# EAGLE design stage1_amp_flat_switch_5V_V1p1 (EAGLE 9.6.2)
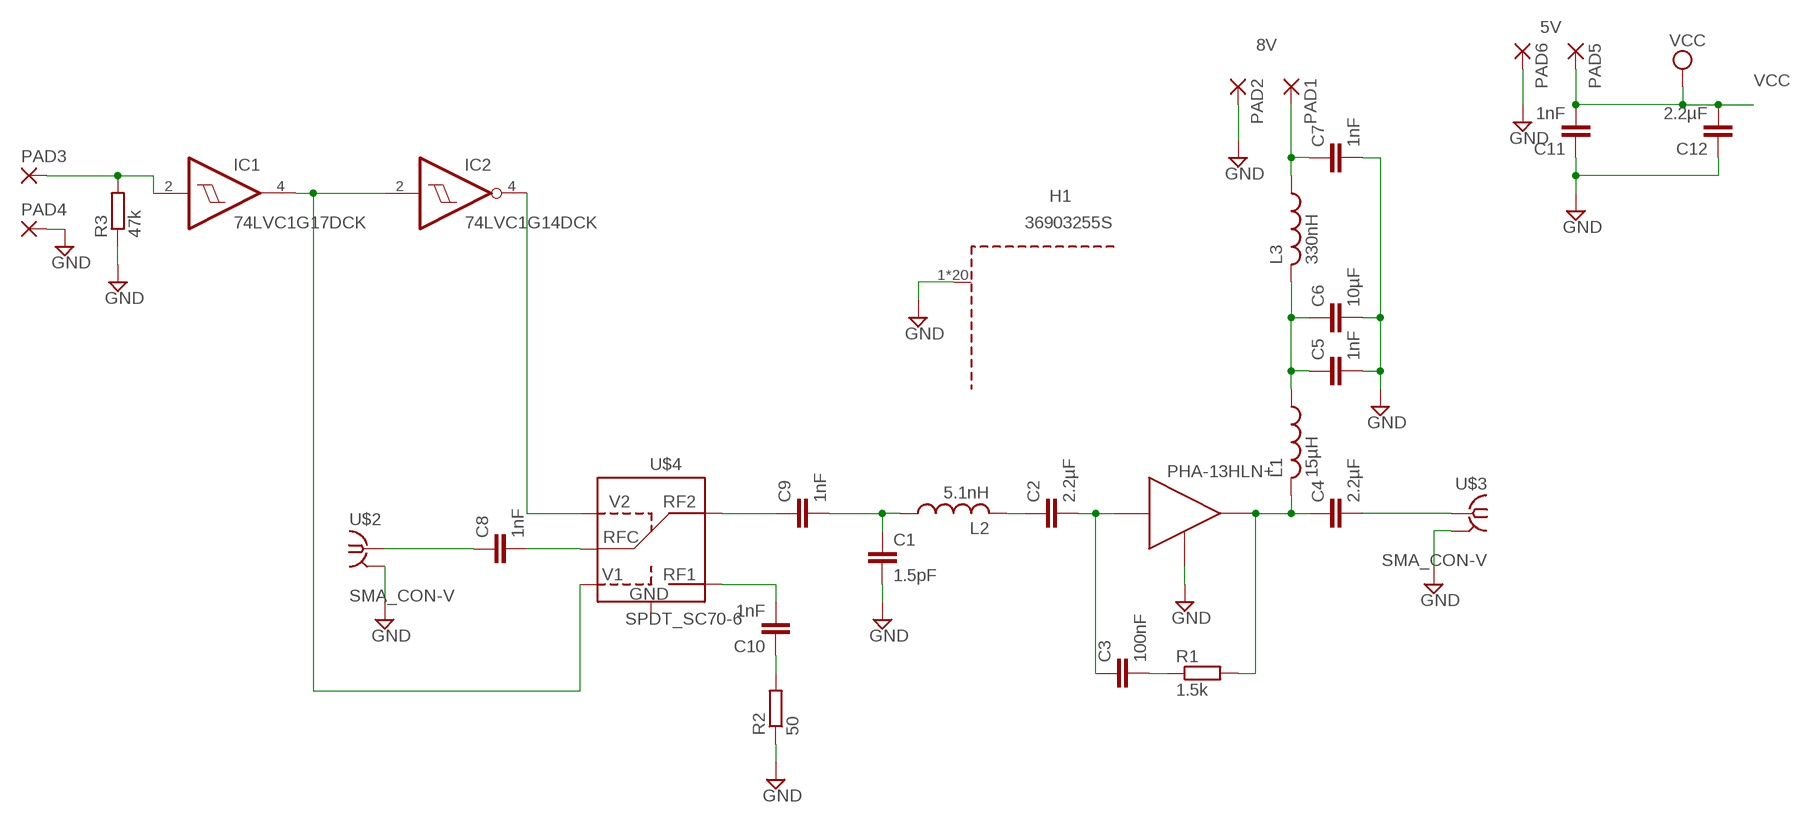
[diagram p0: schematic, sheet 1]

## Parts
C1  1.5pF  C-EUC0402  [C0402]
C2  2.2µF  C-EUC0402  [C0402]
C3  100nF  C-EUC0402  [C0402]
C4  2.2µF  C-EUC0402  [C0402]
C5  1nF  C-EUC0402  [C0402]
C6  10µF  C-EUC0805  [C0805]
C7  1nF  C-EUC0402  [C0402]
C8  1nF  C-EUC0402  [C0402]
C9  1nF  C-EUC0402  [C0402]
C10  1nF  C-EUC0402  [C0402]
C11  1nF  C-EUC0402  [C0402]
C12  2.2µF  C-EUC0402  [C0402]
H1  36903255S  WE-SHC_ONE-PIECE_36903255S  [WE-SHC_ONE-PIECE_36903255S]
IC1  74LVC1G17DCK  [SC70-5]
IC2  74LVC1G14DCK  [SC70-5]
L1  15µH  L-USL3225M  [L3225M]
L2  5.1nH  L-USL2012C  [L2012C]
L3  330nH  L-USL3225M  [L3225M]
PAD1  SMD5  [SMD2,54-5,08]
PAD2  SMD5  [SMD2,54-5,08]
PAD3  SMD5  [SMD2,54-5,08]
PAD4  SMD5  [SMD2,54-5,08]
PAD5  SMD5  [SMD2,54-5,08]
PAD6  SMD5  [SMD2,54-5,08]
R1  1.5k  R-EU_R0402  [R0402]
R2  50  R-EU_R0402  [R0402]
R3  47k  R-EU_R0805  [R0805]
U$1  PHA-13HLN+  TQP3M9008SOT-89  [SOT89]
U$2  SMA_CON-V  [BU-SMA-V]
U$3  SMA_CON-V  [BU-SMA-V]
U$4  SPDT_SC70-6  [SC70-6]

## Nets
GND: C1.2 C5.2 C6.2 C7.2 C11.1 C12.1 H1.1(GND) H1.2(GND) H1.3(GND) H1.4(GND) H1.5(GND) H1.6(GND) H1.7(GND) H1.8(GND) H1.9(GND) H1.10(GND) H1.11(GND) H1.12(GND) H1.13(GND) H1.14(GND) H1.15(GND) H1.16(GND) H1.17(GND) H1.18(GND) H1.19(GND) H1.20(GND) PAD2.1(P) PAD4.1(P) PAD6.1(P) R2.1 R3.1 U$1.2(GND) U$1.2@1(GND) U$2.2(GND) U$2.3(GND) U$2.4(GND) U$2.5(GND) U$3.2(GND) U$3.3(GND) U$3.4(GND) U$3.5(GND)
N$1: C2.1 L2.2
N$2: C2.2 C3.1 U$1.1(IN)
N$3: C4.1 L1.2 R1.2 U$1.3(OUT)
N$4: C1.1 C9.2 L2.1
N$5: C3.2 R1.1
N$6: C4.2 U$3.1
N$7: C5.1 C6.1 L1.1 L3.2
N$8: C7.1 L3.1 PAD1.1(P)
N$9: C8.2 U$4.5(RFC)
N$10: C8.1 U$2.1
N$11: C9.1 U$4.3(RF2)
N$12: C10.2 U$4.1(RF1)
N$13: C10.1 R2.2
N$14: IC1.4(O) IC2.2(I) U$4.6(V1)
N$15: IC2.4(O) U$4.4(V2)
N$16: IC1.2(I) PAD3.1(P) R3.2
VCC: C11.2 C12.2 PAD5.1(P)
Unconnected: U$4.2(GND)

## Notes on the sheet
- 5V
- 8V

## Power pins joined to a net without a drawn wire
GND: IC1.3(GND) IC2.3(GND)
VCC: IC1.5(VCC) IC2.5(VCC)

## Library data of the parts
C1-C12 = rcl:C-EU: CAPACITOR, European symbol; SPICEPREFIX: C
H1 = Wurth_EMC Components_WE-SHC:WE-SHC_ONE-PIECE: WE-SHC Shielding Cabinet for Standard Applications Characteristics Customizable Product Series: Dimensions Shape (Cabi Base material Plating Tin plate in accordance with DIN EN 10202/10203 Two-part case consisting of a solderable grid frame (SMT/THT) and a removable cover Packaged in Tape&Reel for easy pick&place soldering Applications To prevent EMI radiation from PCB and to keep sensitivity low of: – RF output stages – RF input and amplifier stages – Oscillators – EMC sensitive parts in plastic cases <https://www.we-online.com/catalog/media/o14744v209%20Family_WE-SHC_NEU_2017_bearbeitet.jpg> Details see: https://www.we-online.com/catalog/en/WE-SHC Updated by Ella Wu 2019-06-05 2019 (C) Wurth Elektronik; DATASHEET-URL: https://www.we-online.com/catalog/datasheet/36903255S.pdf; HEIGHT: 3mm; LENGTH: 25mm; MOUNT: SMT; PART-NUMBER: 36903255S; WIDTH: 25mm
IC1 = 74xx-little-us:74*1G17: Single Schmitt-Trigger Buffer
IC2 = 74xx-little-us:74*1G14: Single Schmitt-Trigger Inverter Gate
L1-L3 = rcl:L-US: INDUCTOR, American symbol; SPICEPREFIX: L
PAD1-PAD6 = wirepad:SMD5: SMD PAD
R1-R3 = rcl:R-EU_: RESISTOR, European symbol; SPICEPREFIX: R
U$1 = Orzada:TQP3M9008
U$2 U$3 = Orzada:SMA_CON
U$4 = Orzada:SPDT

## Board
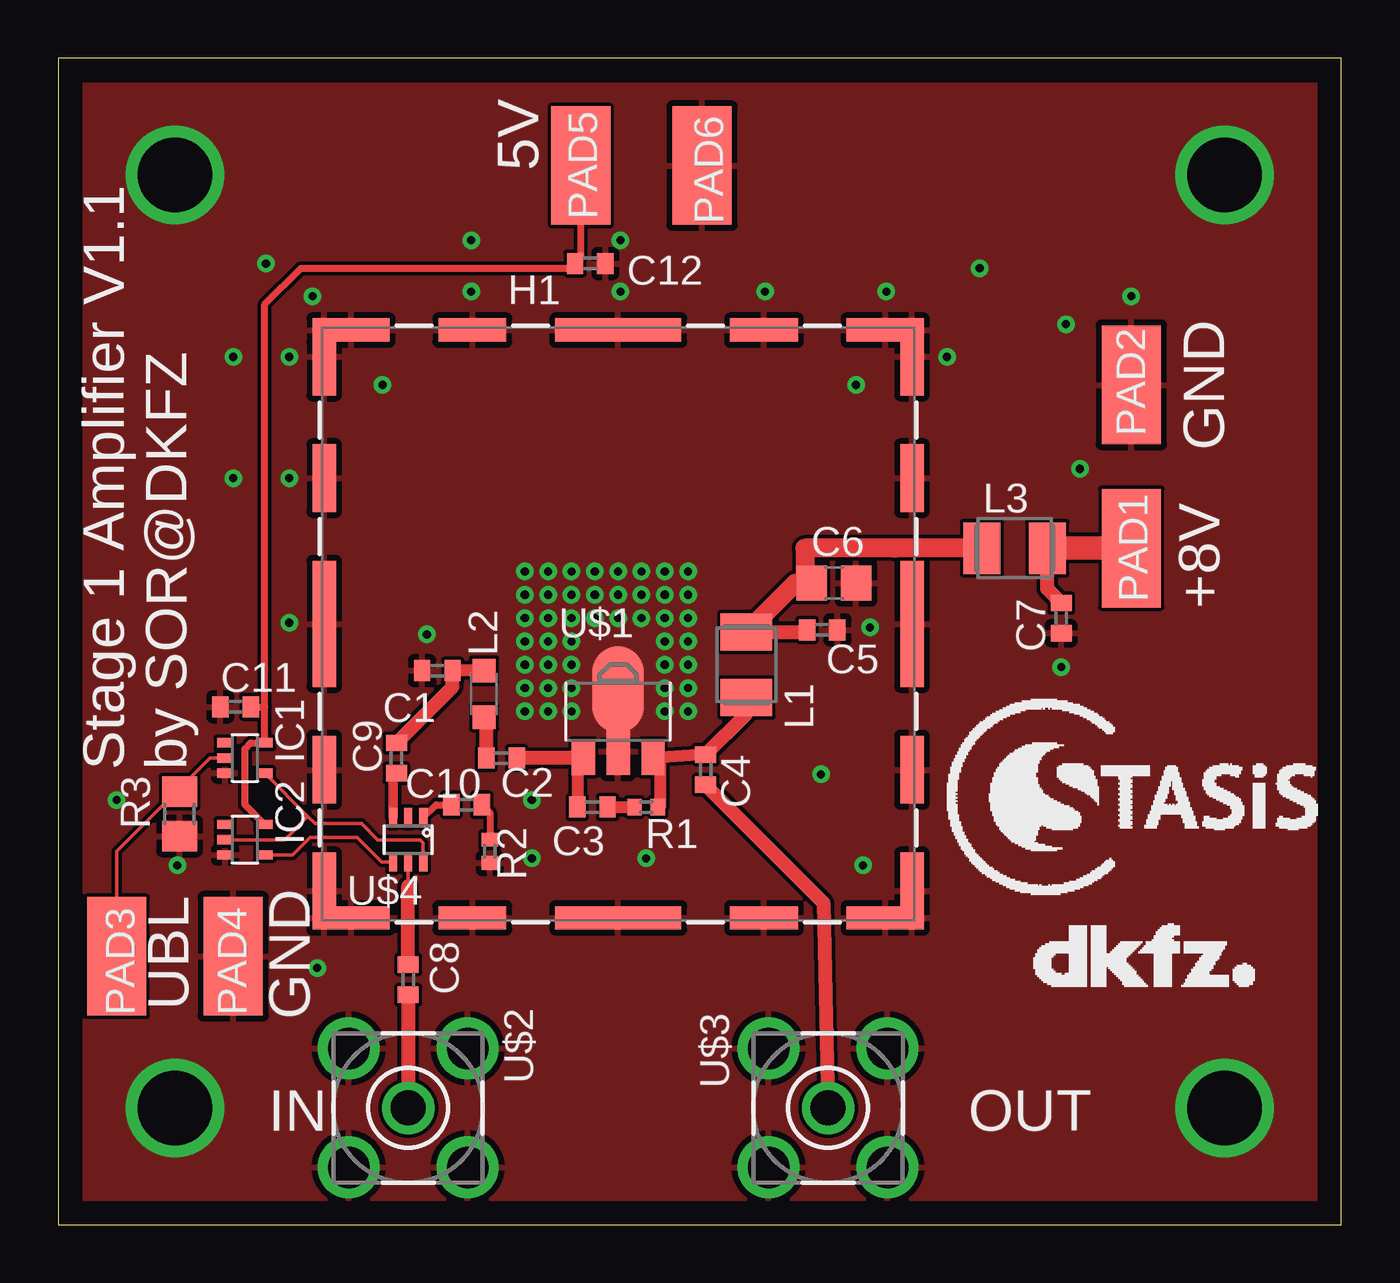
[diagram p1: board, top side]
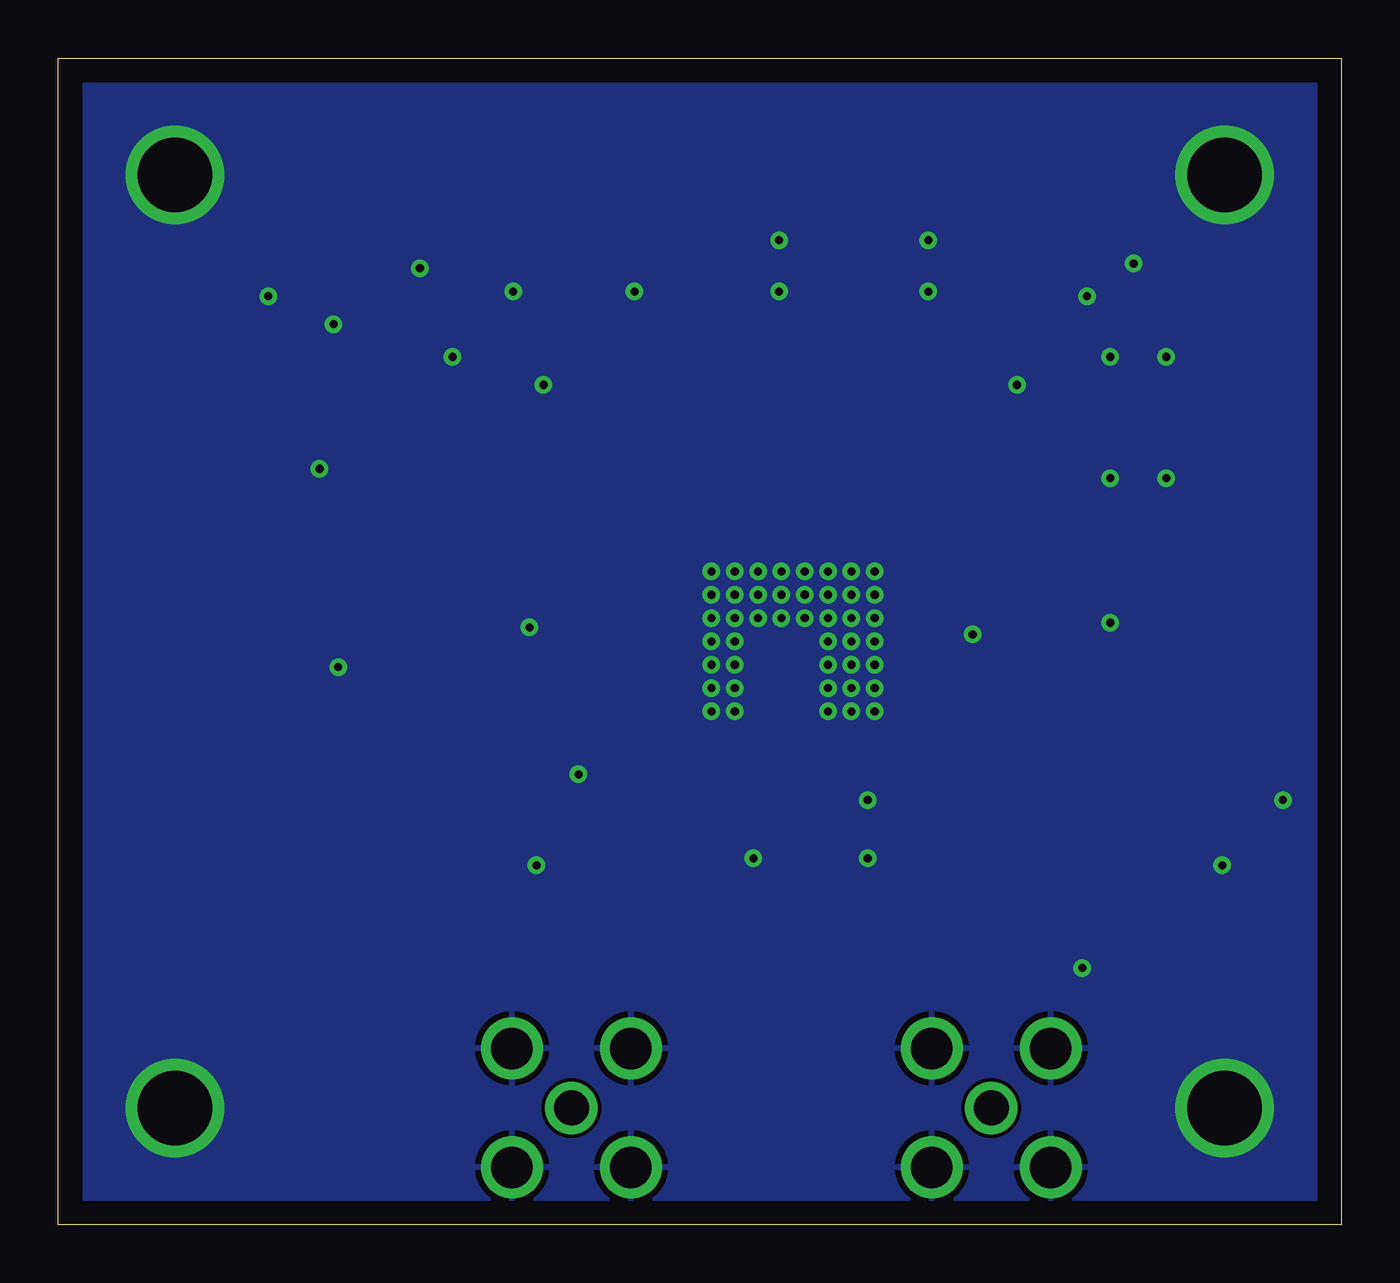
[diagram p2: board, bottom side, seen from below]

Size 55 x 50 mm. Coordinates in mm from the lower left corner, seen from the top.
Outline: 0,0 55,0 55,50 0,50 0,0
Copper layers (1*16): Top 0.035mm / dielectric 1.5mm / Bottom 0.035mm
Design rules "default *": minimum track width 6mil, minimum drill 0.35mm, track to track 6mil, track to pad 6mil, pad to pad 6mil, via to via 6mil, smd to smd 6mil, copper to edge 40mil, drill to drill 6mil, minimum pad ring 10mil, minimum via ring 8mil, stop-mask expansion 4mil, vias tented up to drill 100mil, thermal gap 10mil

### Footprints (pad centres in the part's own frame; a part is rotated, then mirrored left to right if it is on the bottom)
C0402 = smd 0.7 x 0.9: 1 -0.65,0; 2 0.65,0
C0805 = smd 1.3 x 1.5: 1 -0.95,0; 2 0.95,0
WE-SHC_ONE-PIECE_36903255S = smd 3.3 x 1: 1 -11.45,12.6; 5 11.45,12.6; 11 11.45,-12.6; 15 -11.45,-12.6 | smd 2.9 x 1: 2 -6.25,12.6; 4 6.25,12.6; 12 6.25,-12.6; 14 -6.25,-12.6 | smd 5.4 x 1: 3 0,12.6; 13 0,-12.6 | smd 1 x 3.3: 6 12.6,11.45; 10 12.6,-11.45; 16 -12.6,-11.45; 20 -12.6,11.45 | smd 1 x 2.9: 7 12.6,6.25; 9 12.6,-6.25; 17 -12.6,-6.25; 19 -12.6,6.25 | smd 1 x 5.4: 8 12.6,0; 18 -12.6,0
SC70-5 = smd 0.4 x 0.7: 1 -0.65,-0.85; 2 0,-0.85; 3 0.65,-0.85; 4 0.65,0.85; 5 -0.65,0.85
L3225M = smd 1.6 x 2.2: 1 -1.4,0; 2 1.4,0
L2012C = smd 1 x 1: 1 -1,0; 2 1,0
SMD2,54-5,08 = smd 2.54 x 5.08: 1 0,0
R0402 = smd 0.6 x 0.7: 1 -0.5,0; 2 0.5,0
R0805 = smd 1.3 x 1.5: 1 -0.95,0; 2 0.95,0
SOT89 = smd 1 x 1.5: 1 -1.499,-1.981; 3 1.499,-1.981 | smd 1 x 2: 2 0,-1.727 | smd 2.2 x 3.7: 2@1 0,0.94
BU-SMA-V = drill 1.5: 1 0,0 | drill 1.778: 2 -2.55,2.55; 3 2.55,2.55; 4 2.55,-2.55; 5 -2.55,-2.55
SC70-6 = smd 0.35 x 0.8: 1 -0.65,-0.95; 2 0,-0.95; 3 0.65,-0.95; 4 0.65,0.95; 5 0,0.95; 6 -0.65,0.95

### Placement (x,y rotation side)
C1  16.25,23.75 180 top
C2  19,20 0 top
C3  22.9,17.9 0 top
C4  27.75,19.5 270 top
C5  32.75,25.5 0 top
C6  33.25,27.5 0 top
C7  43,26 270 top
C8  15,10.5 90 top
C9  14.5,20 90 top
C10  17.5,18 180 top
C11  7.6,22.2 0 top
C12  22.8,41.2 180 top
H1  24,25.75 0 top
IC1  8,20 270 top
IC2  8,16.5 270 top
L1  29.5,24 270 top
L2  18.25,22.75 270 top
L3  41,29 180 top
PAD1  46,29 0 top
PAD2  46,36 0 top
PAD3  2.5,11.5 180 top
PAD4  7.5,11.5 180 top
PAD5  22.4,45.4 0 top
PAD6  27.6,45.4 0 top
R1  25.2,17.9 0 top
R2  18.5,16 90 top
R3  5.2,17.6 90 top
U$1  24,22 0 top
U$2  15,5 0 top
U$3  33,5 0 top
U$4  15,16.5 180 top
U$5  [LOGO_DKFZ]  41.85,10.15 0 top
U$6  [LOGO_STASIS]  47.05,18.1 0 top

### Tracks (layer width: path | path; a pad name or v marks a point on that pad's centre or on a via)
GND  (via drill 0.35, 3.2)
  other vias: 22,27 23,27 24,27 25,27 26,27 26,26 26,25 26,24 22,24 22,25 22,26 23,26 24,26 25,26 27,24 27,25 27,26 27,27 27,28 26,28 25,28 24,28 23,28 22,28 21,28 21,27 21,26 21,25 21,24 22,23 21,23 26,23 27,23 22,22 21,22 26,22 27,22 20,22 20,23 20,24 20,25 20,26 20,27 20,28 34.8,25.6 20.3,18.2 20.3,15.7 25.2,15.7 15.8,25.3 43,23.9 46,39.8 13.9,36 34.2,36 34.5,15.4 32.7,19.3 5,45 50,45 50,5 5,5 43.2,38.6 43.8,32.4 10.9,39.8 8.9,41.2 9.9,37.2 9.9,32 9.9,25.8 17.7,40 24.1,40 30.3,40 35.5,40 38.1,37.2 39.5,41 24.1,42.2 17.7,42.2 7.5,37.2 7.5,32 5.1,15.4 2.5,18.2 11.1,11
  pour Top (rank 2): 1,49 1,1 54,1 54,49
  pour Bottom: 1,49 1,1 54,1 54,49
  pour Top (no thermals): 21,21 21,27 27,27 27,21
N$1
  Top 0.61: C2.1 18.35,21.65 L2.2
N$2
  Top 0.508: C3.1 22.28,17.94 22.28,20
  Top 0.61: 22.48,20 22.28,20 C2.2
  Top 1.016: U$1.1 22.48,20
N$3
  Top 0.508: R1.2 25.8,17.97 25.8,19.72 U$1.3 25.52,20 C4.1
  Top 0.61: C4.1 29.5,21.9 L1.2
N$4
  Top 0.508: L2.1 C1.1
  Top 0.61: C9.2 16.9,23.05 C1.1
N$5
  Top 0.508: C3.2 R1.1
N$6
  Top 0.61: C4.2 32.8,13.8 U$3.1
N$7
  Top 0.508: L1.1 29.7,25.4
  Top 0.61: L1.1 32,25.4 C5.1
  Top 0.813: L1.1 31.6,27.5 C6.1 32,27.8 32,29 35.86,29 35.87,29.01 L3.2
N$8
  Top 0.61: C7.1 42.4,27.25 L3.1 42.35,29.05
  Top 1.016: PAD1.1 L3.1
N$9
  Top 0.152: 15,14.5 U$4.5
  Top 0.61: C8.2 15,14.5
N$10
  Top 0.61: C8.1 U$2.1
N$11
  Top 0.152: 14.35,19.2 C9.1
  Top 0.406: U$4.3 14.35,19.2
N$12
  Top 0.305: U$4.1 16.2,18 C10.2
N$13
  Top 0.305: C10.1 18.5,17.65 R2.2
N$14
  Top 0.152: U$4.6 15.65,16.35 15.5,16.5 13.7,16.5 13,17.2 11,17.2 10.7,17.5 | IC2.2 9.7,16.5 10.7,17.5 | IC1.4 10.7,17.5
N$15
  Top 0.152: IC2.4 10.05,15.85 10.8,16.6 12.8,16.6 13.85,15.55 U$4.4
N$16
  Top 0.152: PAD3.1 2.5,16 5.15,18.65 | 5.15,18.65 6.5,20 IC1.2 | R3.2 5.2,18.6 5.15,18.65
VCC
  Top 0.152: 22.4,41.45 C12.2
  Top 0.305: IC2.5 8,18 8,20.4 8.25,20.65 IC1.5 8.85,22.2 | 8.85,22.2 8.85,39.45 10.4,41 22.15,41 C12.2 | PAD5.1 22.4,41.45 | C11.2 8.85,22.2

### Text on the board
tPlace: 5V | GND | +8V | Stage 1 Amplifier V1.1 / by SOR@DKFZ | UBL | GND | IN | OUT